# EAGLE schematic fet-2 (EAGLE 7.7.0)
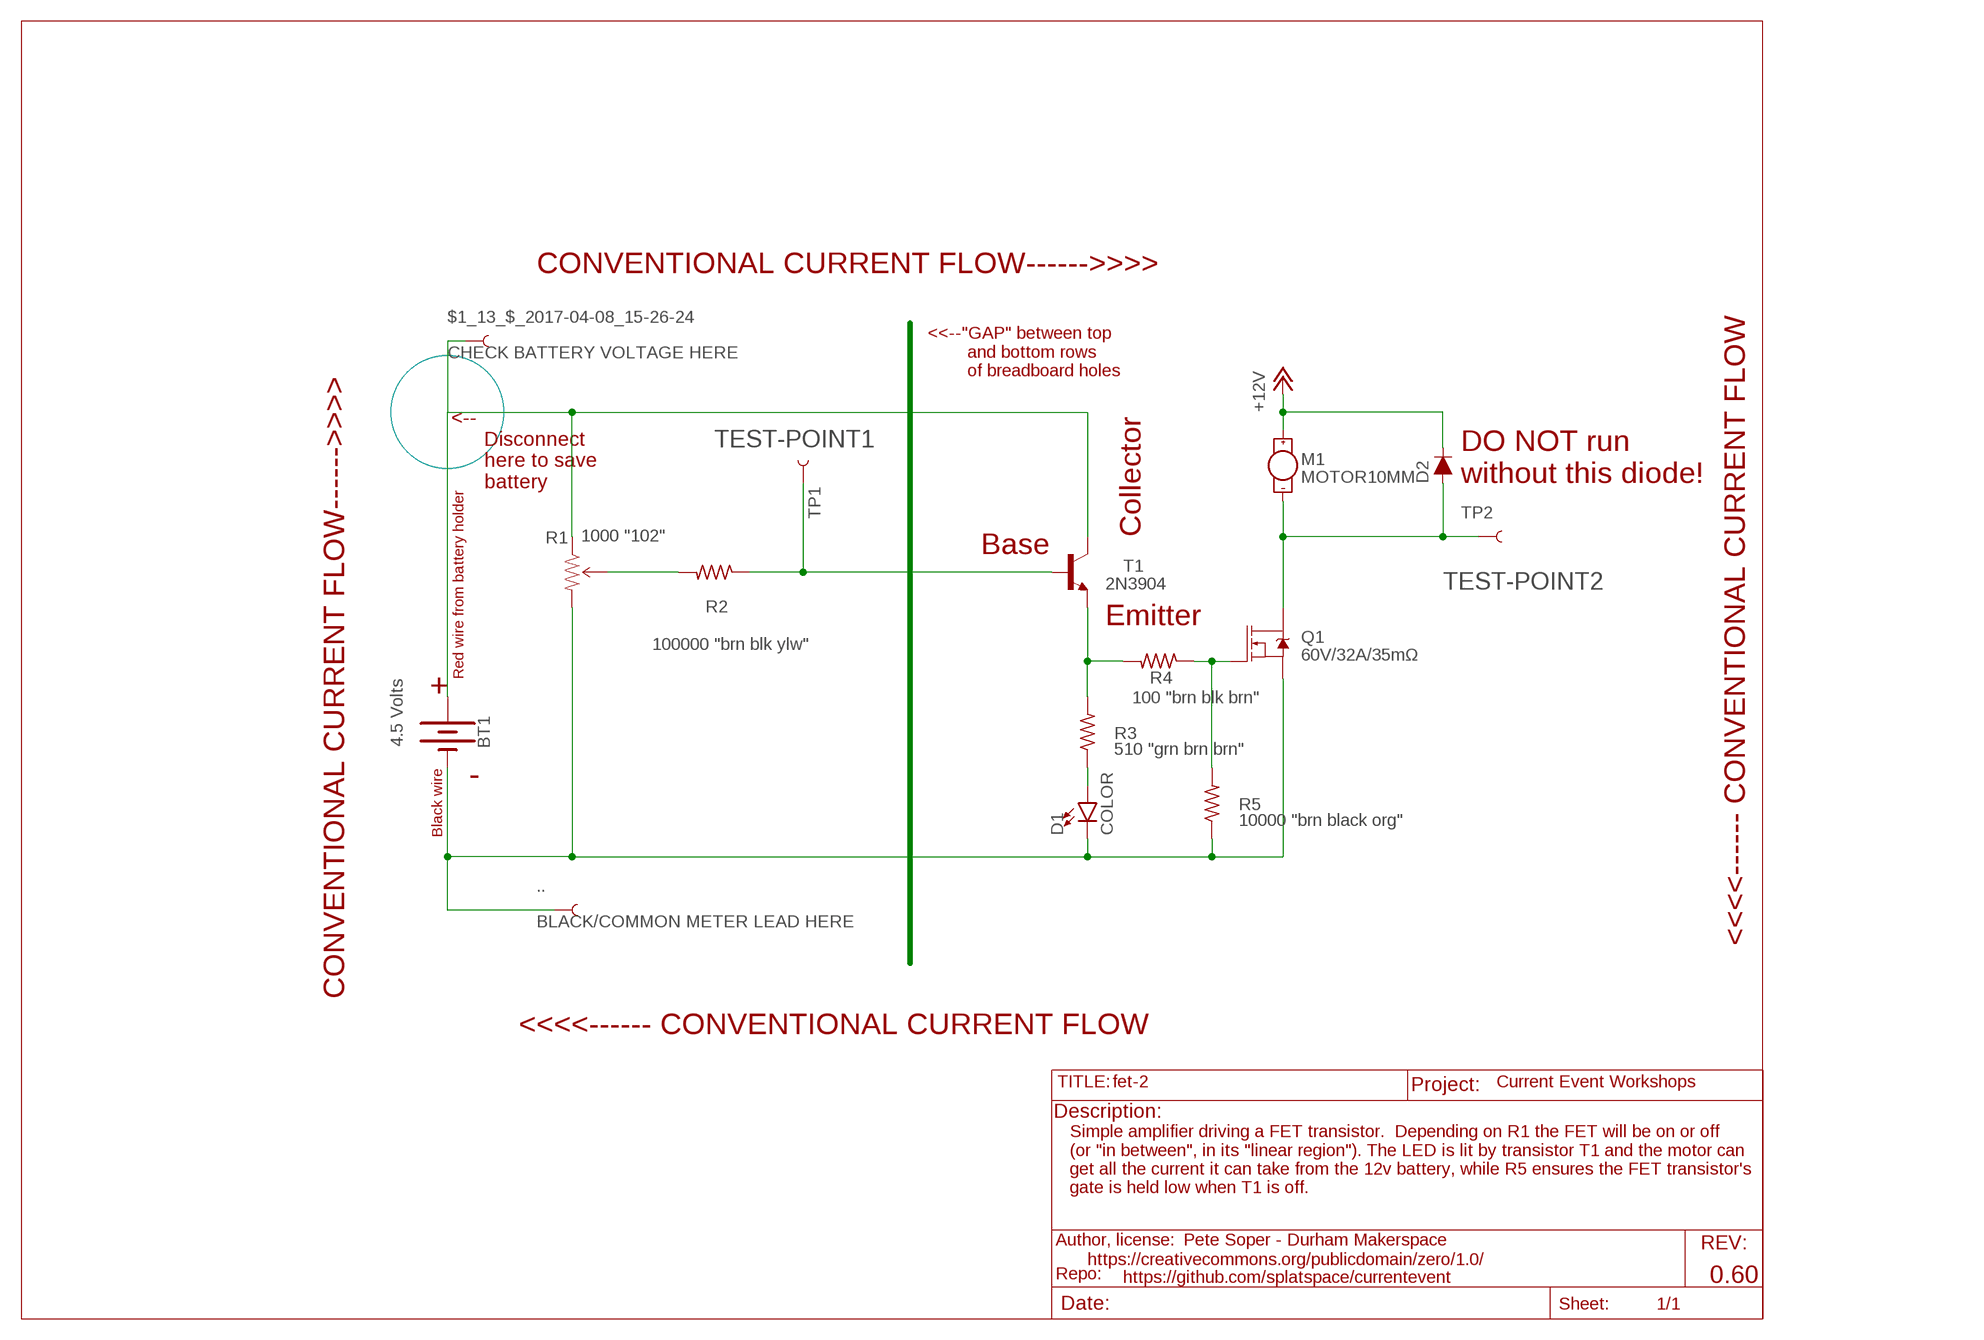
[diagram p0: schematic, sheet 1]

## Parts
$1_13_$_2017-04-08_15-26-24  CHECK BATTERY VOLTAGE HERE  TEST-POINT2  [PAD.02X.02]
..  BLACK/COMMON METER LEAD HERE  TEST-POINT2  [PAD.02X.02]
BT1  4.5 Volts  BATTERY-AAA_KIT  [BATTERY-AAA-KIT]
D1  COLOR  LED5MM  [LED_5MM]
D2  DIODE-1N4148  [DIODE-1N4148]
M1  MOTOR10MM  [VIBE-MOTOR-10MM]
Q1  60V/32A/35mΩ  MOSFET-NCH-FQP30N06L  [TO220V]
R1  1000 "102"  TRIMPOT3362U-2  [3362U-2]
R2  100000 "brn blk ylw"  R-US_0309/12  [0309/12]
R3  510 "grn brn brn"  R-US_0309/12  [0309/12]
R4  100 "brn blk brn"  R-US_0309/12  [0309/12]
R5  10000 "brn black org"  R-US_0309/12  [0309/12]
T1  2N3904  [TO92]
TP1  TEST-POINT1  TEST-POINT2  [PAD.02X.02]
TP2  TEST-POINT2  [PAD.02X.02]

## Nets
+12V: D2.C M1.+
N$1: R3.2 R4.2 T1.3(E)
N$2: R1.2(WIPER) R2.2
N$3: R2.1 T1.2(B) TP1.P$1
N$4: $1_13_$_2017-04-08_15-26-24.P$1 R1.1(CCW) T1.1(C)
N$5: ...P$1 BT1.GND@1(-) D1.K(C) Q1.3(S) R1.3(CW) R5.1
N$7: BT1.PWR@1(+)
N$8: Q1.1(G) R4.1 R5.2
N$9: D1.A R3.1
N$12: D2.A M1.- Q1.2(D) TP2.P$1

## Notes on the sheet
- CONVENTIONAL CURRENT FLOW------>>>>
- CONVENTIONAL CURRENT FLOW------>>>>
- <<--"GAP" between top
          and bottom rows
          of breadboard holes
- DO NOT run
  without this diode!
- <--
        Disconnect
        here to save
        battery
- Collector
- Base
- Emitter
- Red wire from battery holder
- +
- -
- Black wire
- <<<<------ CONVENTIONAL CURRENT FLOW
- <<<<------ CONVENTIONAL CURRENT FLOW
- Current Event Workshops
- Simple amplifier driving a FET transistor.  Depending on R1 the FET will be on or off
  (or "in between", in its "linear region"). The LED is lit by transistor T1 and the motor can
  get all the current it can take from the 12v battery, while R5 ensures the FET transistor's
  gate is held low when T1 is off.
- Pete Soper - Durham Makerspace
- https://creativecommons.org/publicdomain/zero/1.0/
- https://github.com/splatspace/currentevent | 0.60

## Library data of the parts
$1_13_$_2017-04-08_15-26-24 .. TP1 TP2 = SparkFun-Connectors:TEST-POINT: SparkFun Test Points Bare copper test points for troubleshooting or In-Circuit-Testing. These are used by our Production team for verifying production board runs using pogo-pins on test beds. SparkFun Products: SparkFun LSM9DS1 Breakout <https://www.sparkfun.com/products/13284> SparkFun PSOC <https://www.sparkfun.com/products/13714> SparkFun Load Cell Amplifier <https://www.sparkfun.com/products/13879>
BT1 = SparkFun-Batteries:BATTERY: Battery - Single Cell A variety of battery chemistries, sizes, and footprints. Device List: 20MM_PTH - Coin Cell Battery Holder - 20mm (PTH) <https://www.sparkfun.com/products/783> 12MM_SMD - Coin Cell Battery Holder - 12mm (SMD) <https://www.sparkfun.com/products/10592> 12MM_PTH - Coin Cell Battery Holder - 12mm (PTH) <https://www.sparkfun.com/products/7948> 20MM_SMD - 20mm Coin Cell Battery Holder (SMD) (2 legs) Used on the Big Time Watch Kit <https://www.sparkfun.com/products/11734> 20MM_SMD_4LEGS - Coin Cell Battery Holder - 20mm (SMD) <https://www.sparkfun.com/products/11892> 20MM_SMD_4LEGS_OVERPASTE - Coin Cell Battery Holder - 20mm (SMD) <https://www.sparkfun.com/products/11892> (Over-paste on the legs) 24.5MM_PTH - Coin Cell Battery Holder - 24.5mm (PTH) <https://www.sparkfun.com/products/8863> 9V - 9V Battery Holder - PC Mount Used on the SparkFun SparkPunk Sound Kit <https://www.sparkfun.com/products/11177> and SparkFun SparkPunk Sequencer Kit <https://www.sparkfun.com/products/12707> 18650 - Battery Holder - 18650 (PTH) <https://www.sparkfun.com/products/13113> AA - Battery Holder - 1xAA (PTH) <https://www.sparkfun.com/products/7949> AAA - Battery Holder - 1xAAA (PTH) <https://www.sparkfun.com/products/12718> AA_KIT - Battery Holder - 1xAA (PTH) <https://www.sparkfun.com/products/7949> Special kit package - pads only have exposed copper on one side of the board. AAA_KIT - Battery Holder - 1xAAA (PTH) <https://www.sparkfun.com/products/12718> Special kit package - pads only have exposed copper on one side of the board.; PROD_ID: BATT-08571; SF_SKU: PRT-12718
D1 = SparkFun-LED:LED: LED (Generic) Standard schematic elements and footprints for 5mm, 3mm, 1206, and 0603 sized LEDs. Generic LEDs with no color specified.
D2 = SparkFun-DiscreteSemi:DIODE: Diode These are standard reverse protection diodes and small signal diodes. SparkFun Products: SparkFun SparkPunk Sound Kit <https://www.sparkfun.com/products/11177> SparkFun ESP8266 Thing <https://www.sparkfun.com/products/13231>; PROD_ID: DIO-08378; VALUE: 200mA/100V/1V
M1 = SparkFun-Electromechanical:MOTOR: Motor (Single-Phase) Two-terminal, single-phase motors. SparkFun Products Vibration Motor <https://www.sparkfun.com/products/8449> (ROB-08449) Physical dimension and wire connections for this powerful vibration motor. Motor has a self adhesive backing.; PROD_ID: COMP-08572; SF_SKU: ROB-08449
Q1 = SparkFun-DiscreteSemi:MOSFET-NCH: N-channel MOSFETs Voltage controlled devices that allow control of high current outputs. SparkFun Products: SparkFun OpenScale <https://www.sparkfun.com/products/13261> SparkFun Digital Sandbox <https://www.sparkfun.com/products/12651> SparkFun Monster Moto Shield <https://www.sparkfun.com/products/10182> SparkFun MOSFET Power Controller <https://www.sparkfun.com/products/11214>; PROD_ID: TRANS-10060
R1 = SparkFun-Retired:TRIMPOT: Various small potentiometers for "set-and-forget" applications; PROD_ID: RES-08876
R2-R5 = rcl:R-US_: RESISTOR, American symbol
T1 = transistor:2N3904: NPN TRANSISTOR